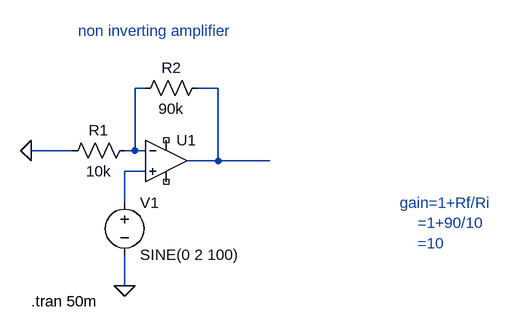
[diagram p0: schematic non inverting amplifier.asc]
non inverting amplifier.asc, the LTspice schematic file:
Version 4.1
SHEET 1 880 680
WIRE 176 48 160 48
WIRE 288 48 256 48
WIRE 64 144 0 144
WIRE 160 144 160 48
WIRE 160 144 144 144
WIRE 176 144 160 144
WIRE 288 160 288 48
WIRE 288 160 240 160
WIRE 368 160 288 160
WIRE 176 176 144 176
WIRE 144 224 144 176
WIRE 144 352 144 304
FLAG 144 352 0
FLAG 0 144 0
SYMBOL OpAmps\\UniversalOpAmp1 208 160 R0
SYMATTR InstName U1
SYMBOL res 160 128 R90
WINDOW 0 0 56 VBottom 2
WINDOW 3 32 56 VTop 2
SYMATTR InstName R1
SYMATTR Value 10k
SYMBOL res 272 32 R90
WINDOW 0 0 56 VBottom 2
WINDOW 3 32 56 VTop 2
SYMATTR InstName R2
SYMATTR Value 90k
SYMBOL voltage 144 208 R0
WINDOW 123 0 0 Left 0
WINDOW 39 0 0 Left 0
SYMATTR InstName V1
SYMATTR Value SINE(0 2 100)
TEXT 0 376 Left 2 !.tran 50m
TEXT 568 224 Left 2 ;gain=1+Rf/Ri\n    =1+90/10\n    =10
TEXT 72 -40 Left 2 ;non inverting amplifier

The netlist it stands for:
* non inverting amplifier.asc
X§U1 N003 N001 NC_01 NC_02 N002 level1 Avol=1Meg GBW=10Meg Vos=0 En=0 Enk=0 In=0 Ink=0 Rin=500Meg  ; pins In+ In- V+ V- OUT
R1 N001 0 10k
R2 N002 N001 90k
V1 N003 0 SINE(0 2 100)
.tran 50m
* gain=1+Rf/Ri
*     =1+90/10
*     =10
* non inverting amplifier
.lib UniversalOpAmp1.lib
.backanno
.end